# EAGLE design jumper (EAGLE 9.3.0)
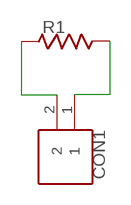
[diagram p0: schematic, sheet 1]

## Parts
CON1  CON-RESISTOR-2_54MM  [CON-RESISTOR-2_54MM]
R1  RESISTOR-0805  [0805]

## Nets
N$1: CON1.1 R1.2
N$2: CON1.2 R1.1

## Library data of the parts
CON1 = SamacSys_Parts:CON-RESISTOR-2_54MM
R1 = SamacSys_Parts:RESISTOR-0805

## Board
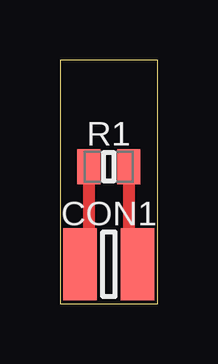
[diagram p1: board, top side]

Size 4.06 x 10.16 mm. Coordinates in mm from the lower left corner, seen from the top.
Outline: 0,0 4.06,0 4.06,10.16 0,10.16 0,0
Copper layers (1*16): Top 0.035mm / dielectric 1.5mm / Bottom 0.035mm
Design rules "default": minimum track width 15mil, minimum drill 0.35mm, track to track 10mil, track to pad 10mil, pad to pad 10mil, via to via 10mil, smd to smd 0mil, copper to edge 0mil, drill to drill 6mil, minimum pad ring 10mil, minimum via ring 8mil, stop-mask expansion 4mil, vias tented up to drill 25mil, thermal gap 10mil

### Footprints (pad centres in the part's own frame; a part is rotated, then mirrored left to right if it is on the bottom)
CON-RESISTOR-2_54MM = smd 1.4 x 3: 1 -1.2,0; 2 1.2,0
0805 = smd 0.97 x 1.47: 1 -0.83,0; 2 0.83,0

### Placement (x,y rotation side)
CON1  2.03,1.65 0 top
R1  2.03,5.71 180 top

### Tracks (layer width: path | path; a pad name or v marks a point on that pad's centre or on a via)
N$1
  Top 0.508: R1.2 1.2,2.02 CON1.1
N$2
  Top 0.508: R1.1 2.86,2.02 CON1.2